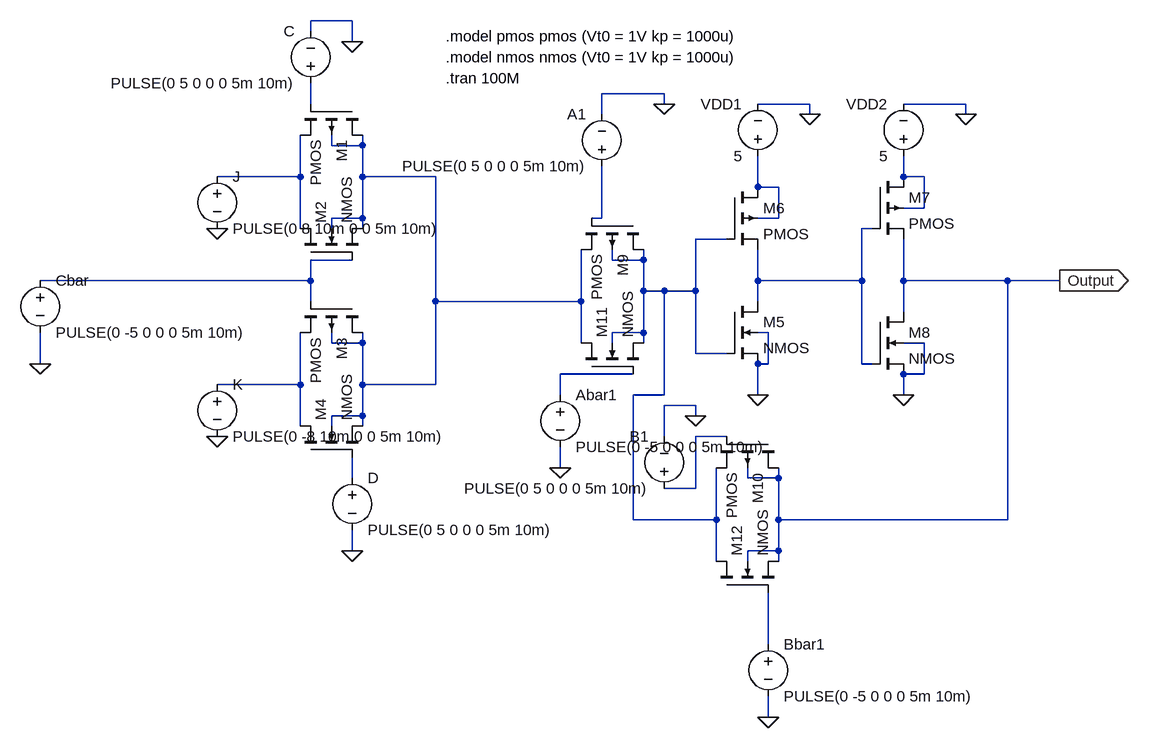
[diagram p0: schematic Exp 8 JK Flip Flop.asc]
Exp 8 JK Flip Flop.asc, the LTspice schematic file:
Version 4
SHEET 1 1388 1032
WIRE 160 -80 96 -80
WIRE 96 -64 96 -80
WIRE 160 -48 160 -80
WIRE 640 32 544 32
WIRE 96 48 96 16
WIRE 640 48 640 32
WIRE 864 48 784 48
WIRE 1104 48 1008 48
WIRE 544 64 544 32
WIRE 864 64 864 48
WIRE 1104 64 1104 48
WIRE 128 112 128 96
WIRE 176 112 176 96
WIRE 176 112 128 112
WIRE 80 160 80 96
WIRE 80 160 -48 160
WIRE 176 160 176 112
WIRE 288 160 176 160
WIRE 1008 160 1008 128
WIRE 1040 160 1008 160
WIRE 784 176 784 128
WIRE 816 176 784 176
WIRE 1040 208 1040 160
WIRE 1040 208 1008 208
WIRE 176 224 176 160
WIRE 176 224 128 224
WIRE 544 224 544 144
WIRE 544 224 528 224
WIRE 816 224 816 176
WIRE 816 224 784 224
WIRE 80 240 80 160
WIRE 128 240 128 224
WIRE 176 240 176 224
WIRE 960 240 944 240
WIRE 736 256 688 256
WIRE 160 288 96 288
WIRE 560 288 560 272
WIRE 608 288 608 272
WIRE 608 288 560 288
WIRE 96 320 96 288
WIRE 96 320 -320 320
WIRE 784 320 784 272
WIRE 944 320 944 240
WIRE 944 320 784 320
WIRE 1008 320 1008 256
WIRE 1168 320 1008 320
WIRE 1248 320 1168 320
WIRE 608 336 608 288
WIRE 640 336 608 336
WIRE 688 336 688 256
WIRE 688 336 640 336
WIRE 96 352 96 320
WIRE 288 352 288 160
WIRE 512 352 512 272
WIRE 512 352 288 352
WIRE 784 352 784 320
WIRE 1008 368 1008 320
WIRE 608 400 608 336
WIRE 608 400 560 400
WIRE 800 400 784 400
WIRE 128 416 128 400
WIRE 176 416 176 400
WIRE 176 416 128 416
WIRE 512 416 512 352
WIRE 560 416 560 400
WIRE 608 416 608 400
WIRE 1040 416 1008 416
WIRE 688 432 688 336
WIRE 736 432 688 432
WIRE -320 448 -320 400
WIRE 800 448 800 400
WIRE 800 448 784 448
WIRE 944 448 944 320
WIRE 960 448 944 448
WIRE 592 464 480 464
WIRE 1040 464 1040 416
WIRE 1040 464 1008 464
WIRE 80 480 80 400
WIRE 80 480 -48 480
WIRE 176 480 176 416
WIRE 288 480 288 352
WIRE 288 480 176 480
WIRE 480 496 480 464
WIRE 640 496 640 336
WIRE 640 496 592 496
WIRE 784 496 784 448
WIRE 1008 496 1008 464
WIRE 688 512 640 512
WIRE 176 528 176 480
WIRE 176 528 128 528
WIRE 688 528 688 512
WIRE 80 544 80 480
WIRE 128 544 128 528
WIRE 176 544 176 528
WIRE 640 560 640 512
WIRE 736 560 688 560
WIRE 480 608 480 576
WIRE 160 624 160 592
WIRE 768 624 768 608
WIRE 816 624 816 608
WIRE 816 624 768 624
WIRE 688 640 688 560
WIRE 688 640 640 640
WIRE 592 688 592 496
WIRE 720 688 720 608
WIRE 720 688 592 688
WIRE 816 688 816 624
WIRE 1168 688 1168 320
WIRE 1168 688 816 688
WIRE 160 736 160 704
WIRE 816 736 816 688
WIRE 816 736 768 736
WIRE 720 752 720 688
WIRE 768 752 768 736
WIRE 816 752 816 736
WIRE 800 880 800 800
WIRE 800 992 800 960
FLAG -48 240 0
FLAG -48 560 0
FLAG 784 496 0
FLAG 1008 496 0
FLAG 864 64 0
FLAG 1104 64 0
FLAG 688 528 0
FLAG 640 48 0
FLAG 800 992 0
FLAG 480 608 0
FLAG 1248 320 Output
IOPIN 1248 320 Out
FLAG 160 -48 0
FLAG 160 736 0
FLAG -320 448 0
SYMBOL pmos4 176 48 R90
SYMATTR InstName M1
SYMATTR Value2 l=5u w=20u
SYMBOL nmos4 80 288 R270
SYMATTR InstName M2
SYMATTR Value2 l=5u w=10u
SYMBOL pmos4 176 352 R90
SYMATTR InstName M3
SYMATTR Value2 l=5u w=20u
SYMBOL nmos4 80 592 R270
SYMATTR InstName M4
SYMATTR Value2 l=5u w=10u
SYMBOL voltage -48 144 R0
WINDOW 123 0 0 Left 0
WINDOW 39 0 0 Left 0
SYMATTR InstName J
SYMATTR Value PULSE(0 8 10m 0 0 5m 10m)
SYMBOL voltage -48 464 R0
WINDOW 123 0 0 Left 0
WINDOW 39 0 0 Left 0
SYMATTR InstName K
SYMATTR Value PULSE(0 -8 10m 0 0 5m 10m)
SYMBOL nmos4 736 352 R0
SYMATTR InstName M5
SYMATTR Value2 l=5u w=10u
SYMBOL pmos4 736 176 R0
SYMATTR InstName M6
SYMATTR Value2 l=5u w=20u
SYMBOL pmos4 960 160 R0
SYMATTR InstName M7
SYMATTR Value2 l=5u w=20u
SYMBOL nmos4 960 368 R0
SYMATTR InstName M8
SYMATTR Value2 l=5u w=10u
SYMBOL voltage 784 144 R180
WINDOW 0 24 96 Left 2
WINDOW 3 24 16 Left 2
WINDOW 123 0 0 Left 0
WINDOW 39 0 0 Left 0
SYMATTR InstName VDD1
SYMATTR Value 5
SYMBOL voltage 1008 144 R180
WINDOW 0 24 96 Left 2
WINDOW 3 24 16 Left 2
WINDOW 123 0 0 Left 0
WINDOW 39 0 0 Left 0
SYMATTR InstName VDD2
SYMATTR Value 5
SYMBOL voltage 544 160 R180
WINDOW 0 24 96 Left 2
WINDOW 3 24 16 Left 2
WINDOW 123 0 0 Left 0
WINDOW 39 0 0 Left 0
SYMATTR InstName A1
SYMATTR Value PULSE(0 5 0 0 0 5m 10m)
SYMBOL voltage 640 656 R180
WINDOW 0 24 96 Left 2
WINDOW 3 24 16 Left 2
WINDOW 123 0 0 Left 0
WINDOW 39 0 0 Left 0
SYMATTR InstName B1
SYMATTR Value PULSE(0 5 0 0 0 5m 10m)
SYMBOL voltage 480 480 R0
WINDOW 123 0 0 Left 0
WINDOW 39 0 0 Left 0
SYMATTR InstName Abar1
SYMATTR Value PULSE(0 -5 0 0 0 5m 10m)
SYMBOL voltage 800 864 R0
WINDOW 123 0 0 Left 0
WINDOW 39 0 0 Left 0
SYMATTR InstName Bbar1
SYMATTR Value PULSE(0 -5 0 0 0 5m 10m)
SYMBOL pmos4 608 224 R90
SYMATTR InstName M9
SYMATTR Value2 l=5u w=20u
SYMBOL pmos4 816 560 R90
SYMATTR InstName M10
SYMATTR Value2 l=5u w=20u
SYMBOL nmos4 512 464 R270
SYMATTR InstName M11
SYMATTR Value2 l=5u w=10u
SYMBOL nmos4 720 800 R270
SYMATTR InstName M12
SYMATTR Value2 l=5u w=10u
SYMBOL voltage 96 32 R180
WINDOW 0 24 96 Left 2
WINDOW 3 24 16 Left 2
WINDOW 123 0 0 Left 0
WINDOW 39 0 0 Left 0
SYMATTR InstName C
SYMATTR Value PULSE(0 5 0 0 0 5m 10m)
SYMBOL voltage 160 608 R0
WINDOW 123 0 0 Left 0
WINDOW 39 0 0 Left 0
SYMATTR InstName D
SYMATTR Value PULSE(0 5 0 0 0 5m 10m)
SYMBOL voltage -320 304 R0
WINDOW 123 0 0 Left 0
WINDOW 39 0 0 Left 0
SYMATTR InstName Cbar
SYMATTR Value PULSE(0 -5 0 0 0 5m 10m)
TEXT 304 -24 Left 2 !.model nmos nmos (Vt0 = 1V kp = 1000u)
TEXT 304 -56 Left 2 !.model pmos pmos (Vt0 = 1V kp = 1000u)
TEXT 304 8 Left 2 !.tran 100M

The netlist it stands for:
* Exp 8 JK Flip Flop.asc
M1 N002 N001 N003 N002 PMOS l=5u w=20u
M2 N003 N009 N002 N002 NMOS l=5u w=10u
M3 N002 N009 N011 N002 PMOS l=5u w=20u
M4 N011 N013 N002 N002 NMOS l=5u w=10u
V§J N003 0 PULSE(0 8 10m 0 0 5m 10m)
V§K N011 0 PULSE(0 -8 10m 0 0 5m 10m)
M5 N007 N008 0 0 NMOS l=5u w=10u
M6 N005 N008 N007 N005 PMOS l=5u w=20u
M7 N004 N007 Output N004 PMOS l=5u w=20u
M8 Output N007 0 0 NMOS l=5u w=10u
VDD1 N005 0 5
VDD2 N004 0 5
V§A1 N006 0 PULSE(0 5 0 0 0 5m 10m)
V§B1 N012 0 PULSE(0 5 0 0 0 5m 10m)
V§Abar1 N010 0 PULSE(0 -5 0 0 0 5m 10m)
V§Bbar1 N014 0 PULSE(0 -5 0 0 0 5m 10m)
M9 N008 N006 N002 N008 PMOS l=5u w=20u
M10 Output N012 N008 Output PMOS l=5u w=20u
M11 N002 N010 N008 N008 NMOS l=5u w=10u
M12 N008 N014 Output Output NMOS l=5u w=10u
V§C N001 0 PULSE(0 5 0 0 0 5m 10m)
V§D N013 0 PULSE(0 5 0 0 0 5m 10m)
V§Cbar N009 0 PULSE(0 -5 0 0 0 5m 10m)
.model NMOS NMOS
.model PMOS PMOS
.lib standard.mos
.model nmos nmos (Vt0 = 1V kp = 1000u)
.model pmos pmos (Vt0 = 1V kp = 1000u)
.tran 100M
.backanno
.end